# Altium schematic sheet 光纖發射.SCHDOC
size A4
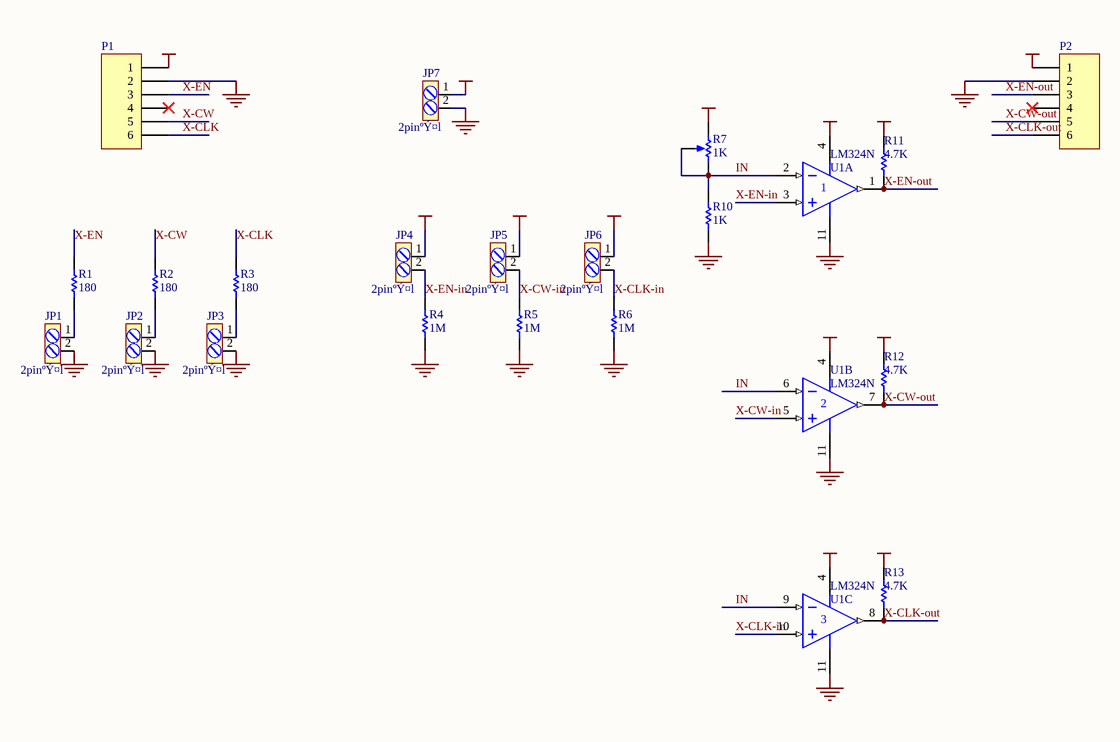
[diagram p0: 光纖發射.SCHDOC]

## Parts
JP1  2pinºÝ¤l  [2PINºÝ¤l-1]
JP2  2pinºÝ¤l  [2PINºÝ¤l-1]
JP3  2pinºÝ¤l  [2PINºÝ¤l-1]
JP4  2pinºÝ¤l  [2PINºÝ¤l-1]
JP5  2pinºÝ¤l  [2PINºÝ¤l-1]
JP6  2pinºÝ¤l  [2PINºÝ¤l-1]
JP7  2pinºÝ¤l  [2PINºÝ¤l-1]
P1  Header 6  [HDR1X6]  (value not drawn)
P2  Header 6  [HDR1X6]  (value not drawn)
R1  value 180  [AXIAL-0.3]  (hidden comment: Res1)
R2  value 180  [AXIAL-0.3]  (hidden comment: Res1)
R3  value 180  [AXIAL-0.3]  (hidden comment: Res1)
R4  value 1M  [AXIAL-0.3]  (hidden comment: Res1)
R5  value 1M  [AXIAL-0.3]  (hidden comment: Res1)
R6  value 1M  [AXIAL-0.3]  (hidden comment: Res1)
R7  value 1K  [VR1]  (hidden comment: RPot)
R10  value 1K  [AXIAL-0.3]  (hidden comment: Res1)
R11  value 4.7K  [AXIAL-0.3]  (hidden comment: Res1)
R12  value 4.7K  [AXIAL-0.3]  (hidden comment: Res1)
R13  value 4.7K  [AXIAL-0.3]  (hidden comment: Res1)
U1  LM324N  [646-06]  (parts A,B,C of 4)

## Nets
+5: JP4.1 JP5.1 JP6.1 JP7.1 P2.1 R7.1(TOP) R11.2 R12.2 R13.2 U1.4(V+)
GND: JP1.2 JP2.2 JP3.2 P1.2
GND1: JP7.2 P2.2 R4.2 R5.2 R6.2 R10.1 U1.11(V-)
VCC: P1.1
IN: R7.2(BOT) R7.3(TAP) R10.2 U1.2(IN-) U1.6(IN-) U1.9(IN-)
X-CLK: P1.6 R3.1
X-CLK-in: JP6.2 R6.1 U1.10(IN+)
X-CLK-out: P2.6 R13.1 U1.8(OUT)
X-CW: P1.5 R2.1
X-CW-in: JP5.2 R5.1 U1.5(IN+)
X-CW-out: P2.5 R12.1 U1.7(OUT)
X-EN: P1.3 R1.2
X-EN-in: JP4.2 R4.1 U1.3(IN+)
X-EN-out: P2.3 R11.1 U1.1(OUT)
NetJP1_1: JP1.1 R1.1
NetJP2_1: JP2.1 R2.2
NetJP3_1: JP3.1 R3.2

Not connected (* = marked no-connect by the designer): P1 4*; P2 4*

## Library data of the parts
P1 P2 = Header 6: Header, 6-Pin; LatestRevisionDate: 17-Jul-2002; LatestRevisionNote: Re-released for DXP Platform.; Publisher: Altium Limited
R1-R6 R10-R13 = Res1: Resistor; Published: 8-Jun-2000; LatestRevisionDate: 17-Jul-2002; LatestRevisionNote: Re-released for DXP Platform.; Publisher: Altium Limited
R7 = RPot: Potentiometer; Sim Note: Enter the Resistance value and the set point into parameter fields.; Set Position: 0.5; Published: 8-Jun-2000; LatestRevisionDate: 17-Jul-2002; LatestRevisionNote: Re-released for DXP Platform.; Publisher: Altium Limited
U1 = LM324N: Quad Low-Power Operational Amplifier; PackageDocument: 1997; Published: 17-Jul-2002; DatasheetDocument: 1988; PackageReference: 646-06; Publisher: Altium Limited